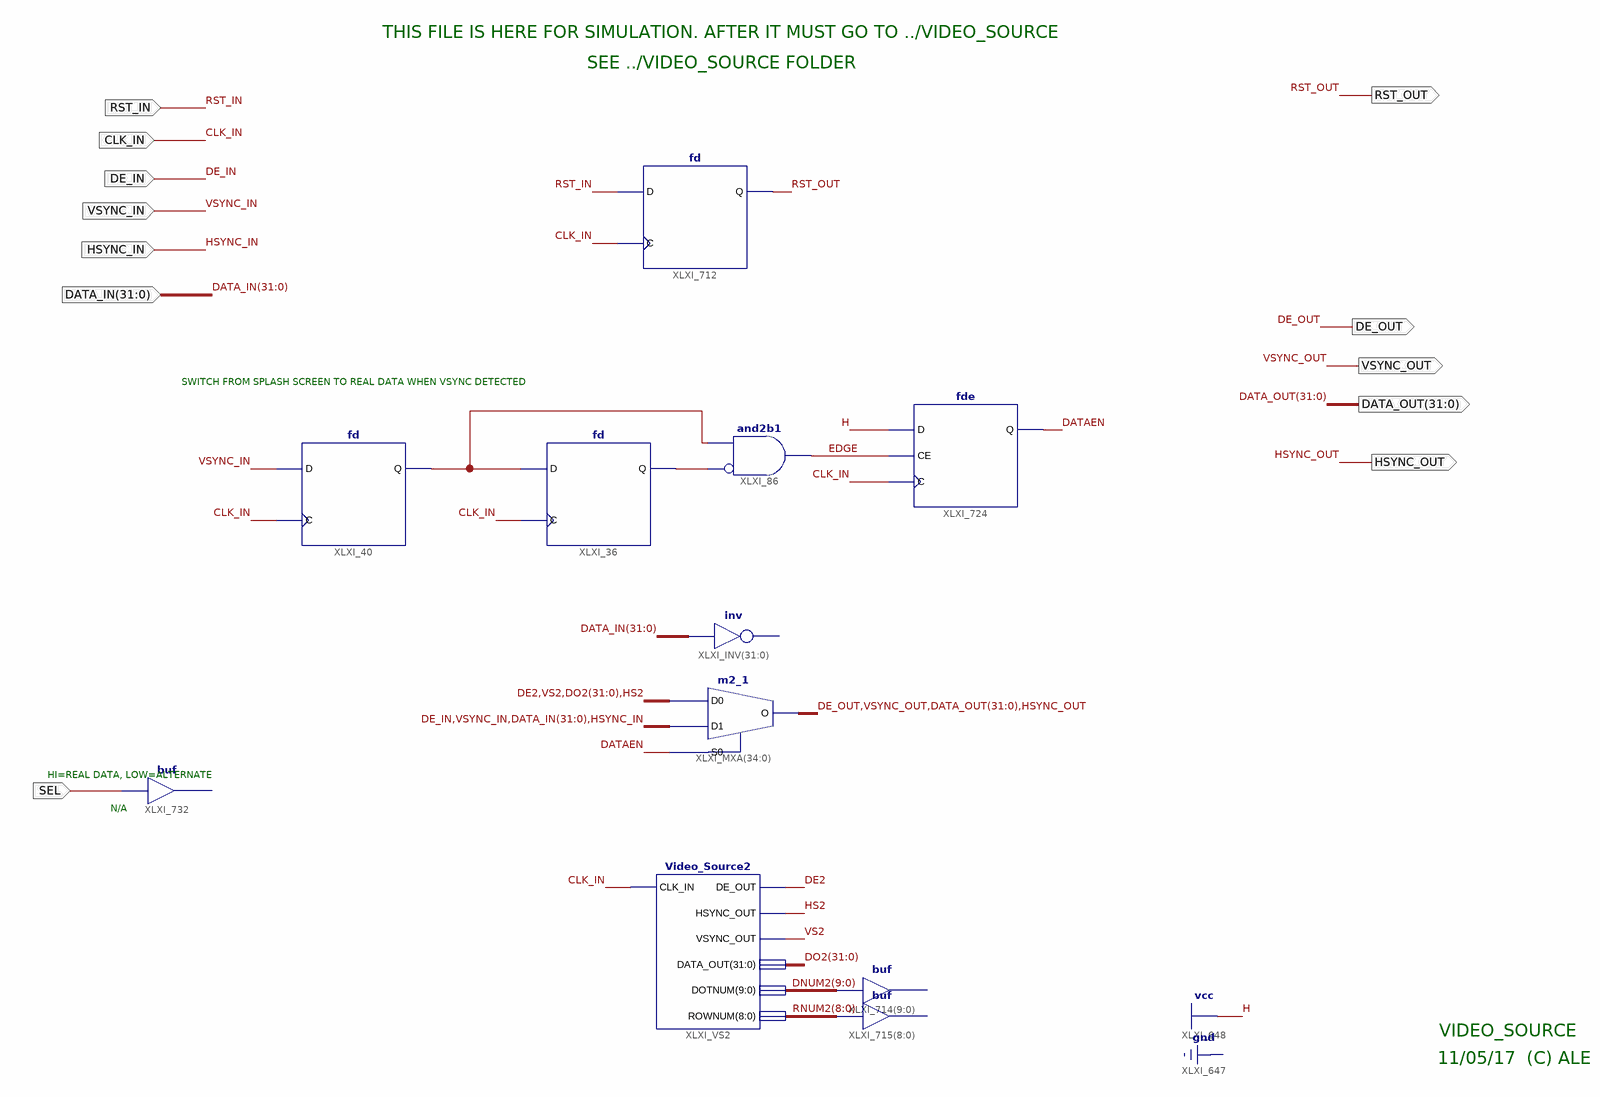
[diagram p0: schematic sheet 1]
// Xilinx ISE schematic Video_Source.sch (zynq) as structural Verilog: 11 symbols, 12 ports
module Video_Source (
  input  RST_IN,
  input  CLK_IN,
  input  DE_IN,
  input  VSYNC_IN,
  input  [31:0] DATA_IN,
  input  SEL,
  input  HSYNC_IN,
  output RST_OUT,
  output DE_OUT,
  output VSYNC_OUT,
  output [31:0] DATA_OUT,
  output HSYNC_OUT
);

  wire DATAEN, DE2, EDGE, HS2, VS2, XLXN_11, XLXN_12;
  wire [8:0] RNUM2;
  wire [9:0] DNUM2;
  wire [31:0] DO2;

  m2_1 XLXI_MXA[34:0] (
    .D0({DE2, VS2, DO2, HS2}), .D1({DE_IN, VSYNC_IN, DATA_IN, HSYNC_IN}), .S0(DATAEN),
    .O({DE_OUT, VSYNC_OUT, DATA_OUT, HSYNC_OUT}));
  // inv XLXI_INV[31..0] has open pins: I=DATA_IN, O=open
  fd XLXI_712 (.C(CLK_IN), .D(RST_IN), .Q(RST_OUT));
  Video_Source2 XLXI_VS2 (
    .CLK_IN(CLK_IN), .DE_OUT(DE2), .HSYNC_OUT(HS2), .VSYNC_OUT(VS2), .DATA_OUT(DO2), .DOTNUM(DNUM2),
    .ROWNUM(RNUM2));
  // buf XLXI_714[9..0] has open pins: I=DNUM2, O=open
  // buf XLXI_715[8..0] has open pins: I=RNUM2, O=open
  fd #(.INIT("1")) XLXI_36 (.C(CLK_IN), .D(XLXN_12), .Q(XLXN_11));
  fd #(.INIT("1")) XLXI_40 (.C(CLK_IN), .D(VSYNC_IN), .Q(XLXN_12));
  and XLXI_86 (EDGE, ~XLXN_11, XLXN_12);  // and2b1
  fde XLXI_724 (.C(CLK_IN), .CE(EDGE), .D(1'b1), .Q(DATAEN));
  // buf XLXI_732 has open pins: I=SEL, O=open

  // Notes on the sheet:
  //   THIS FILE IS HERE FOR SIMULATION. AFTER IT MUST GO TO ../VIDEO_SOURCE
  //   SEE ../VIDEO_SOURCE FOLDER
  //   SWITCH FROM SPLASH SCREEN TO REAL DATA WHEN VSYNC DETECTED
  //   HI=REAL DATA, LOW=ALTERNATE
  //   N/A
  //   VIDEO_SOURCE
  //   11/05/17  (C) ALE
endmodule
